# Altium schematic sheet Lens-Maker.SchDoc: Title
size A4; Date: *******; ApprovedBy: *******; CheckedBy: None; Author: *******; CompanyName: *******; DrawnBy: Name; Engineer: *******; Organization: *******; Address1: *******; Address2: *******; Address3: *******; Address4: *******; DocumentNumber: 1; Revision: *******; SheetNumber: 1; SheetTotal: 11; CurrentTime: *******; CurrentDate: *******; Time: *******; DocumentFullPathAndName: *******; DocumentName: *******; ModifiedDate: *******; ImagePath: *******; ProjectName: *******; Application_BuildNumber: *******
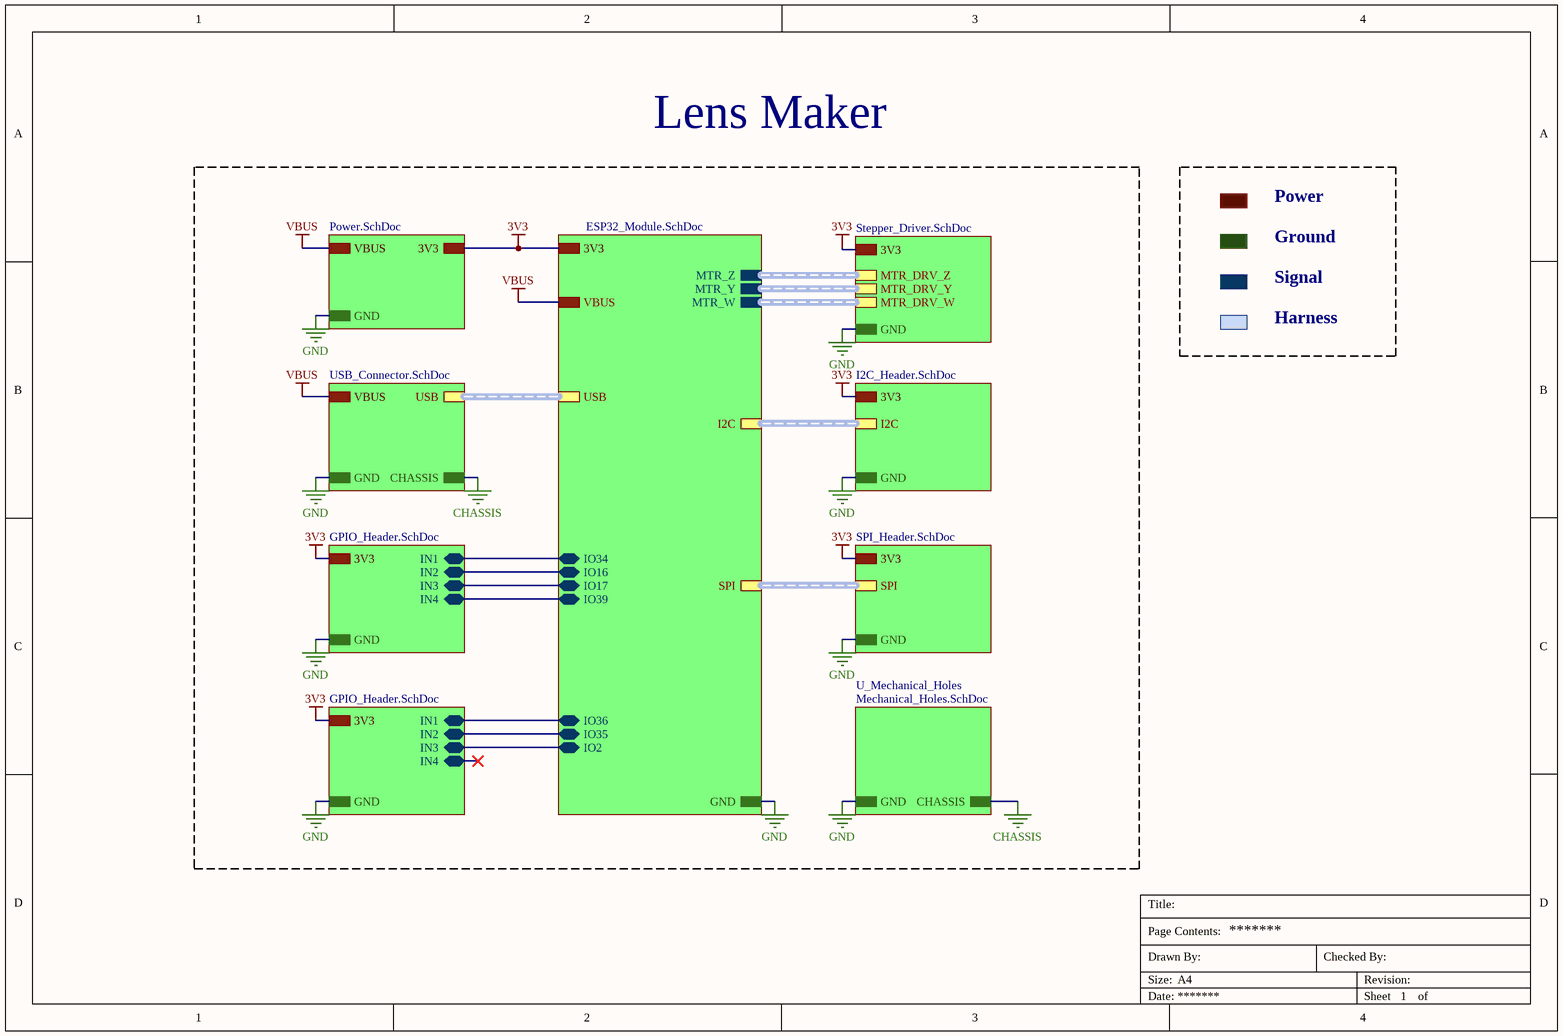
[diagram p0: Lens-Maker.SchDoc]

## Sub-sheets
U_ESP32_Module = ESP32_Module.SchDoc: 3V3, GND, MTR_Z (harness MTR_DRV), MTR_W (harness MTR_DRV), MTR_Y (harness MTR_DRV), IO34 (bidir), IO16 (bidir), IO17 (bidir), I2C (harness I2C), SPI (harness SPI), IO39 (bidir), IO36 (bidir), IO35 (bidir), IO2 (bidir), VBUS, USB (harness USB)
U_GPIO_Header = GPIO_Header.SchDoc: 3V3, GND, IN1 (bidir), IN2 (bidir), IN3 (bidir), IN4 (bidir)
U_GPIO_Header = GPIO_Header.SchDoc: 3V3, GND, IN1 (bidir), IN2 (bidir), IN3 (bidir), IN4 (bidir)
U_I2C_Header = I2C_Header.SchDoc: 3V3, GND, I2C (harness I2C)
U_Mechanical_Holes = Mechanical_Holes.SchDoc: GND, CHASSIS
U_Power = Power.SchDoc: 3V3, GND, VBUS
U_SPI_Header = SPI_Header.SchDoc: 3V3, GND, SPI (harness SPI)
U_Stepper_Driver = Stepper_Driver.SchDoc: 3V3, GND, MTR_DRV_Z (harness MTR_DRV), MTR_DRV_Y (harness MTR_DRV), MTR_DRV_W (harness MTR_DRV)
U_USB_Connector = USB_Connector.SchDoc: GND, CHASSIS, VBUS, USB (harness USB)

## Nets
3V3: sheet U_ESP32_Module/3V3, sheet U_GPIO_Header/3V3, sheet U_I2C_Header/3V3, sheet U_SPI_Header/3V3, sheet U_Stepper_Driver/3V3, sheet U_GPIO_Header/3V3, sheet U_Power/3V3
CHASSIS: sheet U_USB_Connector/CHASSIS, sheet U_Mechanical_Holes/CHASSIS
GND: sheet U_ESP32_Module/GND, sheet U_GPIO_Header/GND, sheet U_I2C_Header/GND, sheet U_SPI_Header/GND, sheet U_Stepper_Driver/GND, sheet U_GPIO_Header/GND, sheet U_USB_Connector/GND, sheet U_Power/GND, sheet U_Mechanical_Holes/GND
VBUS: sheet U_ESP32_Module/VBUS, sheet U_USB_Connector/VBUS, sheet U_Power/VBUS
(unnamed): sheet U_ESP32_Module/IO34, sheet U_GPIO_Header/IN1
(unnamed): sheet U_ESP32_Module/IO16, sheet U_GPIO_Header/IN2
(unnamed): sheet U_ESP32_Module/IO17, sheet U_GPIO_Header/IN3
(unnamed): sheet U_ESP32_Module/IO39, sheet U_GPIO_Header/IN4
(unnamed): sheet U_ESP32_Module/IO36, sheet U_GPIO_Header/IN1
(unnamed): sheet U_ESP32_Module/IO35, sheet U_GPIO_Header/IN2
(unnamed): sheet U_ESP32_Module/IO2, sheet U_GPIO_Header/IN3

## Buses and harness runs
harness sheet U_ESP32_Module/I2C = sheet U_I2C_Header/I2C
harness sheet U_ESP32_Module/MTR_W = sheet U_Stepper_Driver/MTR_DRV_W
harness sheet U_ESP32_Module/MTR_Y = sheet U_Stepper_Driver/MTR_DRV_Y
harness sheet U_ESP32_Module/MTR_Z = sheet U_Stepper_Driver/MTR_DRV_Z
harness sheet U_ESP32_Module/SPI = sheet U_SPI_Header/SPI
harness sheet U_ESP32_Module/USB = sheet U_USB_Connector/USB

## Notes on the sheet
- Lens Maker
- Power
- Ground
- Signal
- Harness
- Title:
- Size:
- Date:
- Drawn By:
- Page Contents:
- A4
- Checked By:
- Revision:
- Sheet
- of